# Altium project A7 Minima.PrjPcb (part 2 of 3)

## Sheet 5-3 fpga bank 14-16.SchDoc
size A4; SheetNumber: 7; SheetTotal: 13
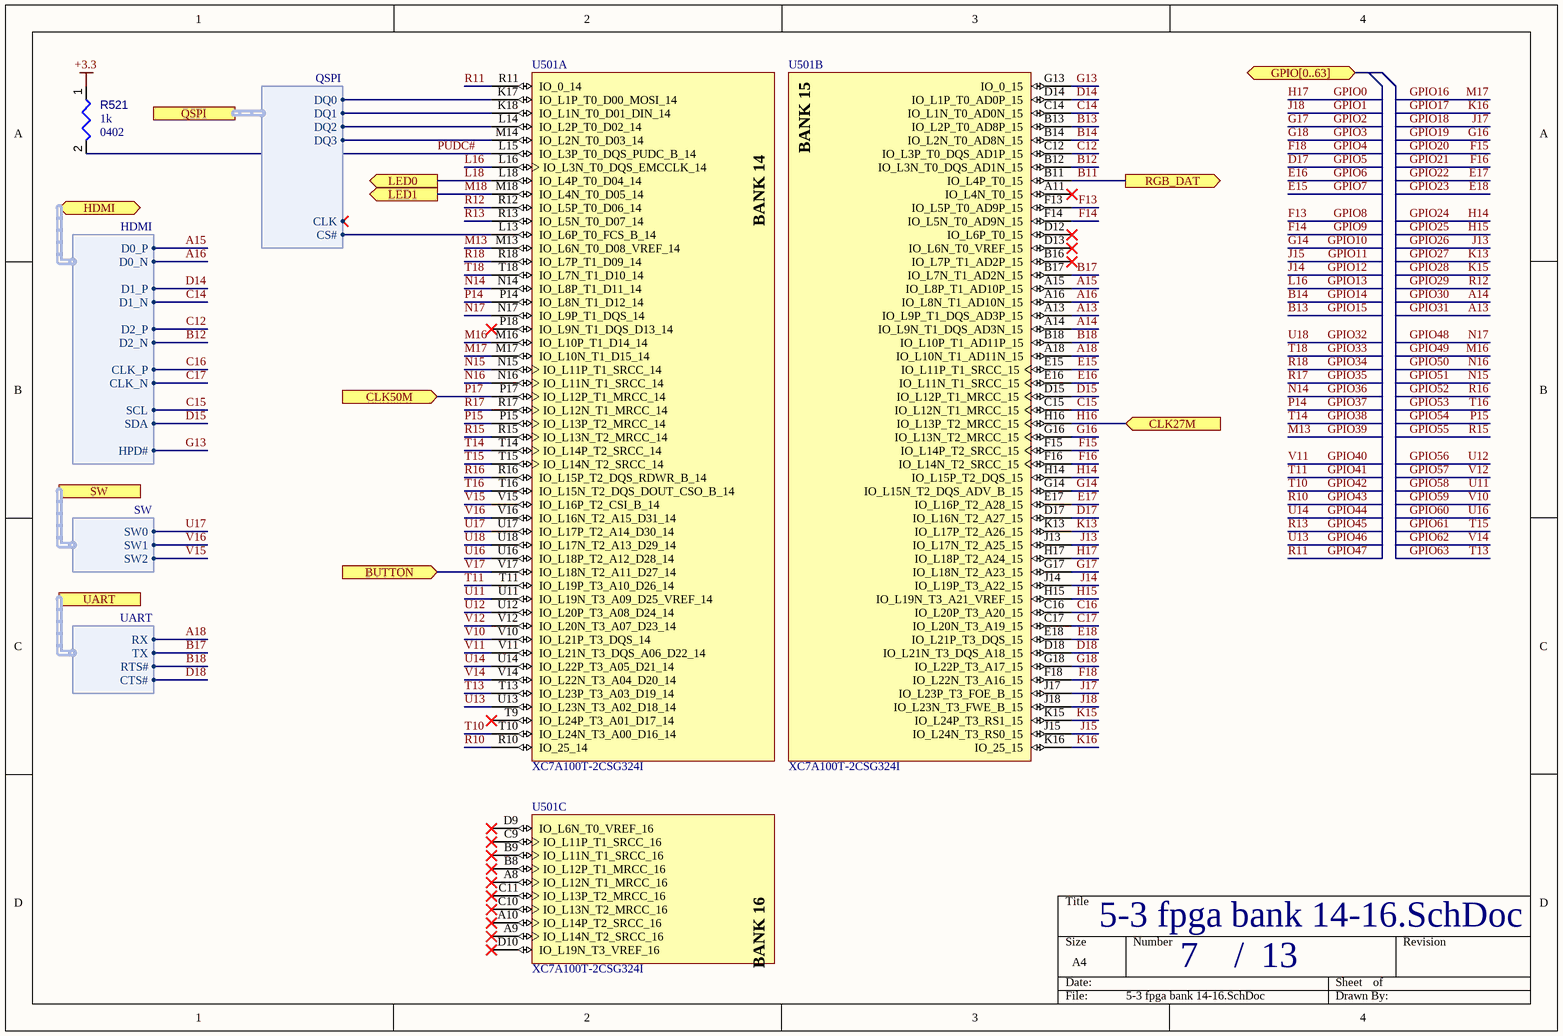
[diagram p7: 5-3 fpga bank 14-16.SchDoc]

### Parts
R521  value 1k  Case/Package: 0402  [RESC0402(1005)_L]  (hidden comment: Resistors,0402,1k)
U501  XC7A100T-2CSG324I  [CSG324]  (parts A,B,C of 9)

### Ports
BUTTON (in), CLK27M (in), CLK50M (in), GPIO[0..63] (bidir), HDMI (bidir, harness HDMI), LED0 (out), LED1 (out), QSPI (harness QSPI), RGB_DAT (out), SW (harness SW), UART (harness UART)

### Harnesses
QSPI: DQ0, DQ1, DQ2, DQ3, CS#, CLK
UART: TX, RX, RTS#, CTS#
SW: SW1, SW0, SW2
HDMI: D0_P, D0_N, D1_P, D1_N, D2_P, D2_N, CLK_P, CLK_N, SCL, SDA, HPD#

### Nets
+3.3: R521.1
A13: U501.A13(IO_L9P_T1_DQS_AD3P_15)  [also labelled GPIO31]  [project net A13_7]
A14: U501.A14(IO_L9N_T1_DQS_AD3N_15)  [also labelled GPIO30]  [project net A14_7]
A15: U501.A15(IO_L8P_T1_AD10P_15) ; port HDMI.D0_P  [project net HDMI.D0_P]
A16: U501.A16(IO_L8N_T1_AD10N_15) ; port HDMI.D0_N  [project net HDMI.D0_N]
A18: U501.A18(IO_L10N_T1_AD11N_15) ; port UART.RX  [project net UART.RX]
B11: U501.B11(IO_L4P_T0_15) ; port RGB_DAT  [project net RGB_DAT]
B12: U501.B12(IO_L3N_T0_DQS_AD1N_15) ; port HDMI.D2_N  [project net HDMI.D2_N]
B13: U501.B13(IO_L2P_T0_AD8P_15)  [also labelled GPIO15]  [project net B13_7]
B14: U501.B14(IO_L2N_T0_AD8N_15)  [also labelled GPIO14]  [project net B14_7]
B17: U501.B17(IO_L7N_T1_AD2N_15) ; port UART.TX  [project net UART.TX]
B18: U501.B18(IO_L10P_T1_AD11P_15) ; port UART.RTS#  [project net UART.RTS#]
C12: U501.C12(IO_L3P_T0_DQS_AD1P_15) ; port HDMI.D2_P  [project net HDMI.D2_P]
C14: U501.C14(IO_L1N_T0_AD0N_15) ; port HDMI.D1_N  [project net HDMI.D1_N]
C15: U501.C15(IO_L12N_T1_MRCC_15) ; port HDMI.SCL  [project net HDMI.SCL]
C16: U501.C16(IO_L20P_T3_A20_15) ; port HDMI.CLK_P  [project net HDMI.CLK_P]
C17: U501.C17(IO_L20N_T3_A19_15) ; port HDMI.CLK_N  [project net HDMI.CLK_N]
D14: U501.D14(IO_L1P_T0_AD0P_15) ; port HDMI.D1_P  [project net HDMI.D1_P]
D15: U501.D15(IO_L12P_T1_MRCC_15) ; port HDMI.SDA  [project net HDMI.SDA]
D17: U501.D17(IO_L16N_T2_A27_15)  [also labelled GPIO5]  [project net D17_7]
D18: U501.D18(IO_L21N_T3_DQS_A18_15) ; port UART.CTS#  [project net UART.CTS#]
E15: U501.E15(IO_L11P_T1_SRCC_15)  [also labelled GPIO7]  [project net E15_7]
E16: U501.E16(IO_L11N_T1_SRCC_15)  [also labelled GPIO6]  [project net E16_7]
E17: U501.E17(IO_L16P_T2_A28_15)  [also labelled GPIO22]  [project net E17_7]
E18: U501.E18(IO_L21P_T3_DQS_15)  [also labelled GPIO23]  [project net E18_7]
F13: U501.F13(IO_L5P_T0_AD9P_15)  [also labelled GPIO8]  [project net F13_7]
F14: U501.F14(IO_L5N_T0_AD9N_15)  [also labelled GPIO9]  [project net F14_7]
F15: U501.F15(IO_L14P_T2_SRCC_15)  [also labelled GPIO20]  [project net F15_7]
F16: U501.F16(IO_L14N_T2_SRCC_15)  [also labelled GPIO21]  [project net F16_7]
F18: U501.F18(IO_L22N_T3_A16_15)  [also labelled GPIO4]  [project net F18_7]
G13: U501.G13(IO_0_15) ; port HDMI.HPD#  [project net HDMI.HPD#]
G14: U501.G14(IO_L15N_T2_DQS_ADV_B_15)  [also labelled GPIO10]  [project net G14_7]
G16: U501.G16(IO_L13N_T2_MRCC_15)  [also labelled GPIO19]  [project net G16_7]
G17: U501.G17(IO_L18N_T2_A23_15)  [also labelled GPIO2]  [project net G17_7]
G18: U501.G18(IO_L22P_T3_A17_15)  [also labelled GPIO3]  [project net G18_7]
GPIO0: U501.H17(IO_L18P_T2_A24_15)  [also labelled H17]  [project net GPIO0_7]
GPIO1: U501.J18(IO_L23N_T3_FWE_B_15)  [also labelled J18]  [project net GPIO1_7]
GPIO11: U501.J15(IO_L24N_T3_RS0_15)  [also labelled J15]  [project net GPIO11_7]
GPIO12: U501.J14(IO_L19P_T3_A22_15)  [also labelled J14]  [project net GPIO12_7]
GPIO13: U501.L16(IO_L3N_T0_DQS_EMCCLK_14)  [also labelled L16]  [project net GPIO13_7]
GPIO16: U501.M17(IO_L10N_T1_D15_14)  [also labelled M17]  [project net GPIO16_7]
GPIO17: U501.K16(IO_25_15)  [also labelled K16]  [project net GPIO17_7]
GPIO18: U501.J17(IO_L23P_T3_FOE_B_15)  [also labelled J17]  [project net GPIO18_7]
GPIO24: U501.H14(IO_L15P_T2_DQS_15)  [also labelled H14]  [project net GPIO24_7]
GPIO25: U501.H15(IO_L19N_T3_A21_VREF_15)  [also labelled H15]  [project net GPIO25_7]
GPIO26: U501.J13(IO_L17N_T2_A25_15)  [also labelled J13]  [project net GPIO26_7]
GPIO27: U501.K13(IO_L17P_T2_A26_15)  [also labelled K13]  [project net GPIO27_7]
GPIO28: U501.K15(IO_L24P_T3_RS1_15)  [also labelled K15]  [project net GPIO28_7]
GPIO29: U501.R12(IO_L5P_T0_D06_14)  [also labelled R12]  [project net GPIO29_7]
GPIO32: U501.U18(IO_L17N_T2_A13_D29_14)  [also labelled U18]  [project net GPIO32_7]
GPIO33: U501.T18(IO_L7N_T1_D10_14)  [also labelled T18]  [project net GPIO33_7]
GPIO34: U501.R18(IO_L7P_T1_D09_14)  [also labelled R18]  [project net GPIO34_7]
GPIO35: U501.R17(IO_L12N_T1_MRCC_14)  [also labelled R17]  [project net GPIO35_7]
GPIO36: U501.N14(IO_L8P_T1_D11_14)  [also labelled N14]  [project net GPIO36_7]
GPIO37: U501.P14(IO_L8N_T1_D12_14)  [also labelled P14]  [project net GPIO37_7]
GPIO38: U501.T14(IO_L14P_T2_SRCC_14)  [also labelled T14]  [project net GPIO38_7]
GPIO39: U501.M13(IO_L6N_T0_D08_VREF_14)  [also labelled M13]  [project net GPIO39_7]
GPIO40: U501.V11(IO_L21N_T3_DQS_A06_D22_14)  [also labelled V11]  [project net GPIO40_7]
GPIO41: U501.T11(IO_L19P_T3_A10_D26_14)  [also labelled T11]  [project net GPIO41_7]
GPIO42: U501.T10(IO_L24N_T3_A00_D16_14)  [also labelled T10]  [project net GPIO42_7]
GPIO43: U501.R10(IO_25_14)  [also labelled R10]  [project net GPIO43_7]
GPIO44: U501.U14(IO_L22P_T3_A05_D21_14)  [also labelled U14]  [project net GPIO44_7]
GPIO45: U501.R13(IO_L5N_T0_D07_14)  [also labelled R13]  [project net GPIO45_7]
GPIO46: U501.U13(IO_L23N_T3_A02_D18_14)  [also labelled U13]  [project net GPIO46_7]
GPIO47: U501.R11(IO_0_14)  [also labelled R11]  [project net GPIO47_7]
GPIO48: U501.N17(IO_L9P_T1_DQS_14)  [also labelled N17]  [project net GPIO48_7]
GPIO49: U501.M16(IO_L10P_T1_D14_14)  [also labelled M16]  [project net GPIO49_7]
GPIO50: U501.N16(IO_L11N_T1_SRCC_14)  [also labelled N16]  [project net GPIO50_7]
GPIO51: U501.N15(IO_L11P_T1_SRCC_14)  [also labelled N15]  [project net GPIO51_7]
GPIO52: U501.R16(IO_L15P_T2_DQS_RDWR_B_14)  [also labelled R16]  [project net GPIO52_7]
GPIO53: U501.T16(IO_L15N_T2_DQS_DOUT_CSO_B_14)  [also labelled T16]  [project net GPIO53_7]
GPIO54: U501.P15(IO_L13P_T2_MRCC_14)  [also labelled P15]  [project net GPIO54_7]
GPIO55: U501.R15(IO_L13N_T2_MRCC_14)  [also labelled R15]  [project net GPIO55_7]
GPIO56: U501.U12(IO_L20P_T3_A08_D24_14)  [also labelled U12]  [project net GPIO56_7]
GPIO57: U501.V12(IO_L20N_T3_A07_D23_14)  [also labelled V12]  [project net GPIO57_7]
GPIO58: U501.U11(IO_L19N_T3_A09_D25_VREF_14)  [also labelled U11]  [project net GPIO58_7]
GPIO59: U501.V10(IO_L21P_T3_DQS_14)  [also labelled V10]  [project net GPIO59_7]
GPIO60: U501.U16(IO_L18P_T2_A12_D28_14)  [also labelled U16]  [project net GPIO60_7]
GPIO61: U501.T15(IO_L14N_T2_SRCC_14)  [also labelled T15]  [project net GPIO61_7]
GPIO62: U501.V14(IO_L22N_T3_A04_D20_14)  [also labelled V14]  [project net GPIO62_7]
GPIO63: U501.T13(IO_L23P_T3_A03_D19_14)  [also labelled T13]  [project net GPIO63_7]
H16: U501.H16(IO_L13P_T2_MRCC_15) ; port CLK27M  [project net CLK27M]
L18: U501.L18(IO_L4P_T0_D04_14) ; port LED0  [project net LED0]
M18: U501.M18(IO_L4N_T0_D05_14) ; port LED1  [project net LED1]
P17: U501.P17(IO_L12P_T1_MRCC_14) ; port CLK50M  [project net CLK50M]
PUDC#: R521.2 U501.L15(IO_L3P_T0_DQS_PUDC_B_14)  [project net PUDC#_7]
QSPI.CS#: U501.L13(IO_L6P_T0_FCS_B_14) ; port QSPI.CS#
QSPI.DQ0: U501.K17(IO_L1P_T0_D00_MOSI_14) ; port QSPI.DQ0
QSPI.DQ1: U501.K18(IO_L1N_T0_D01_DIN_14) ; port QSPI.DQ1
QSPI.DQ2: U501.L14(IO_L2P_T0_D02_14) ; port QSPI.DQ2
QSPI.DQ3: U501.M14(IO_L2N_T0_D03_14) ; port QSPI.DQ3
U17: U501.U17(IO_L17P_T2_A14_D30_14) ; port SW.SW0  [project net SW.SW0]
V15: U501.V15(IO_L16P_T2_CSI_B_14) ; port SW.SW2  [project net SW.SW2]
V16: U501.V16(IO_L16N_T2_A15_D31_14) ; port SW.SW1  [project net SW.SW1]
V17: U501.V17(IO_L18N_T2_A11_D27_14) ; port BUTTON  [project net BUTTON]

Not connected (* = marked no-connect by the designer): U501 A8(IO_L12N_T1_MRCC_16)* A9(IO_L14N_T2_SRCC_16)* A10(IO_L14P_T2_SRCC_16)* A11(IO_L4N_T0_15)* B8(IO_L12P_T1_MRCC_16)* B9(IO_L11N_T1_SRCC_16)* B16(IO_L7P_T1_AD2P_15)* C9(IO_L11P_T1_SRCC_16)* C10(IO_L13N_T2_MRCC_16)* C11(IO_L13P_T2_MRCC_16)* D9(IO_L6N_T0_VREF_16)* D10(IO_L19N_T3_VREF_16)* D12(IO_L6P_T0_15)* D13(IO_L6N_T0_VREF_15)* P18(IO_L9N_T1_DQS_D13_14)* T9(IO_L24P_T3_A01_D17_14)*

### Notes on the sheet
- /
- (in symbol CMP-0364-00002-3, part A) BANK 14
- (in symbol CMP-0364-00002-3, part B) BANK 15
- (in symbol CMP-0364-00002-3, part C) BANK 16

### Library data of the parts
R521 = Resistors: Resistor; Component Type: Resistors
U501 = CMP-0364-00002-3: as U501 on sheet 5-1 fgpa power; ComponentLink5URL: http://www.xilinx.com/support/documentation/user_guides/ug475_7Series_Pkg_Pinout.pdf; ComponentLink4Description: Package File; PackageDescription: Wire-Bond Chip-Scale BGA, Body 15 x 15 mm, 0.8 mm Pitch; RoHS: Pb-Free; ComponentLink5Description: Packaging and Pinout; ComponentLink2URL: http://www.xilinx.com/support/documentation/user_guides/ug475_7Series_Pkg_Pinout.pdf; ComponentLink2Description: Package Specification; PartNumber: XC7A100T-2CSG324I; Mounting Technology: Surface Mount; ComponentLink3Description: DC and Switching Characteristics; PackageVersion: Rev 1.8; Code_JEDEC: MO-275-KKAC-1; PackageReference: CSG324; NexusDeviceID: XC7A100T-2CSG324I; ComponentLink4URL: http://www.xilinx.com/support/packagefiles/a7packages/xc7a100tcsg324pkg.txt; ComponentLink3URL: http://www.xilinx.com/support/documentation/data_sheets/ds181_Artix_7_Data_Sheet.pdf; ComponentLink1Description: Datasheet; DatasheetVersion: v1.12; ComponentLink1URL: http://www.xilinx.com/support/documentation/data_sheets/ds180_7Series_Overview.pdf; Generic Part Number: XC7A100T; CLBs (Max Distributed RAM Kb): 1188

## Sheet 4 jtag uart.SchDoc
size A4; SheetNumber: 4; SheetTotal: 13
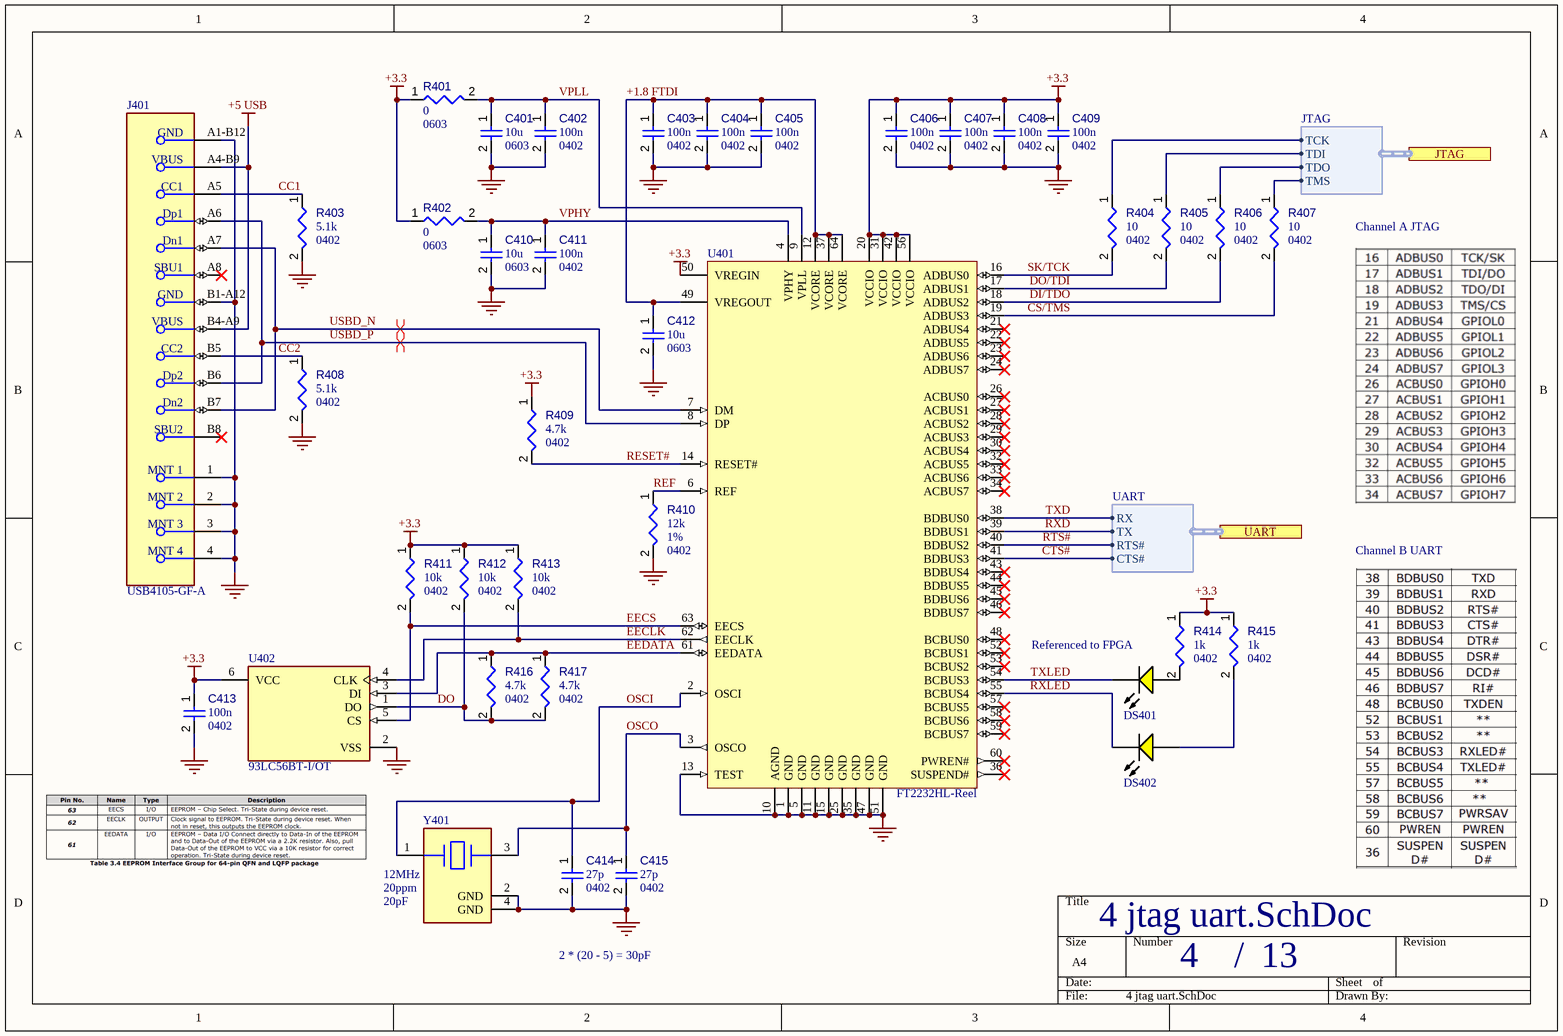
[diagram p8: 4 jtag uart.SchDoc]

### Parts
C401  value 10u  Case/Package: 0603  [CAPC0603(1608)100_L]  (hidden comment: Capacitors,0603,10u)
C402  value 100n  Case/Package: 0402  [CAPC0402(1005)60_L]  (hidden comment: Capacitors,0402,100n,16)
C403  value 100n  Case/Package: 0402  [CAPC0402(1005)60_L]  (hidden comment: Capacitors,0402,100n,16)
C404  value 100n  Case/Package: 0402  [CAPC0402(1005)60_L]  (hidden comment: Capacitors,0402,100n,16)
C405  value 100n  Case/Package: 0402  [CAPC0402(1005)60_L]  (hidden comment: Capacitors,0402,100n,16)
C406  value 100n  Case/Package: 0402  [CAPC0402(1005)60_L]  (hidden comment: Capacitors,0402,100n,16)
C407  value 100n  Case/Package: 0402  [CAPC0402(1005)60_L]  (hidden comment: Capacitors,0402,100n,16)
C408  value 100n  Case/Package: 0402  [CAPC0402(1005)60_L]  (hidden comment: Capacitors,0402,100n,16)
C409  value 100n  Case/Package: 0402  [CAPC0402(1005)60_L]  (hidden comment: Capacitors,0402,100n,16)
C410  value 10u  Case/Package: 0603  [CAPC0603(1608)100_L]  (hidden comment: Capacitors,0603,10u)
C411  value 100n  Case/Package: 0402  [CAPC0402(1005)60_L]  (hidden comment: Capacitors,0402,100n,16)
C412  value 10u  Case/Package: 0603  [CAPC0603(1608)100_L]  (hidden comment: Capacitors,0603,10u)
C413  value 100n  Case/Package: 0402  [CAPC0402(1005)60_L]  (hidden comment: Capacitors,0402,100n,16)
C414  value 27p  Case/Package: 0402  [CAPC0402(1005)60_L]  (hidden comment: Capacitors,0402,27p)
C415  value 27p  Case/Package: 0402  [CAPC0402(1005)60_L]  (hidden comment: Capacitors,0402,27p)
DS401  SML-LX0603YW-TR  [LUMX-SML-LX0603_V]  (value not drawn)
DS402  SML-LX0603YW-TR  [LUMX-SML-LX0603_V]  (value not drawn)
J401  USB4105-GF-A  [FP-USB4105-GF-A-MFG]
R401  value 0  Case/Package: 0603  [RESC0603(1608)_L]  (hidden comment: Resistors,0603,0)
R402  value 0  Case/Package: 0603  [RESC0603(1608)_L]  (hidden comment: Resistors,0603,0)
R403  value 5.1k  Case/Package: 0402  [RESC0402(1005)_L]  (hidden comment: Resistors,0402,5.1k)
R404  value 10  Case/Package: 0402  [RESC0402(1005)_L]  (hidden comment: Resistors,0402,10)
R405  value 10  Case/Package: 0402  [RESC0402(1005)_L]  (hidden comment: Resistors,0402,10)
R406  value 10  Case/Package: 0402  [RESC0402(1005)_L]  (hidden comment: Resistors,0402,10)
R407  value 10  Case/Package: 0402  [RESC0402(1005)_L]  (hidden comment: Resistors,0402,10)
R408  value 5.1k  Case/Package: 0402  [RESC0402(1005)_L]  (hidden comment: Resistors,0402,5.1k)
R409  value 4.7k  Case/Package: 0402  [RESC0402(1005)_L]  (hidden comment: Resistors,0402,4.7k)
R410  value 12k  Case/Package: 0402  Tolerance: 1%  [RESC0402(1005)_L]  (hidden comment: Resistors,0402,1%,12k)
R411  value 10k  Case/Package: 0402  [RESC0402(1005)_L]  (hidden comment: Resistors,0402,10k)
R412  value 10k  Case/Package: 0402  [RESC0402(1005)_L]  (hidden comment: Resistors,0402,10k)
R413  value 10k  Case/Package: 0402  [RESC0402(1005)_L]  (hidden comment: Resistors,0402,10k)
R414  value 1k  Case/Package: 0402  [RESC0402(1005)_L]  (hidden comment: Resistors,0402,1k)
R415  value 1k  Case/Package: 0402  [RESC0402(1005)_L]  (hidden comment: Resistors,0402,1k)
R416  value 4.7k  Case/Package: 0402  [RESC0402(1005)_L]  (hidden comment: Resistors,0402,4.7k)
R417  value 4.7k  Case/Package: 0402  [RESC0402(1005)_L]  (hidden comment: Resistors,0402,4.7k)
U401  FT2232HL-Reel  [LQFP-64_L]
U402  93LC56BT-I/OT  [FP-C04-028-MFG]
Y401  Frequency: 12MHz  Frequency Stability: 20ppm  Load Capacitance: 20pF  [FP-NX3225SA-MFG]  (hidden comment: NX3225SA-12.000M-STD-CRS-2)

### Ports
JTAG (harness JTAG), UART (harness UART)

### Harnesses
UART: TX, RX, RTS#, CTS#
JTAG: TCK, TDI, TDO, TMS

### Nets
+3.3: C406.1 C407.1 C408.1 C409.1 C413.1 R401.1 R402.1 R409.1 R411.1 R412.1 R413.1 R414.1 R415.1 U401.20(VCCIO) U401.31(VCCIO) U401.42(VCCIO) U401.50(VREGIN) U401.56(VCCIO) U402.6(VCC)
+5 USB: J401.A4-B9(VBUS) J401.B4-A9(VBUS)
GND: C401.2 C402.2 C403.2 C404.2 C405.2 C406.2 C407.2 C408.2 C409.2 C410.2 C411.2 C412.2 C413.2 C414.2 C415.2 J401.1(MNT_1) J401.2(MNT_2) J401.3(MNT_3) J401.4(MNT_4) J401.A1-B12(GND) J401.B1-A12(GND) R403.2 R408.2 R410.2 U401.1(GND) U401.5(GND) U401.10(AGND) U401.11(GND) U401.13(TEST) U401.15(GND) U401.25(GND) U401.35(GND) U401.47(GND) U401.51(GND) U402.2(VSS) Y401.2(GND) Y401.4(GND)
+1.8 FTDI: C403.1 C404.1 C405.1 C412.1 U401.12(VCORE) U401.37(VCORE) U401.49(VREGOUT) U401.64(VCORE)  [project net +1.8 FTDI_4]
CC1: J401.A5(CC1) R403.1  [project net CC1_4]
CC2: J401.B5(CC2) R408.1  [project net CC2_4]
CS/TMS: R407.2 U401.19(ADBUS3)  [project net CS/TMS_4]
CTS#: U401.41(BDBUS3) ; port UART.CTS#  [project net UART.CTS#]
DI/TDO: R406.2 U401.18(ADBUS2)  [project net DI/TDO_4]
DO: R412.2 R416.2 R417.2 U402.1(DO)  [project net DO_4]
DO/TDI: R405.2 U401.17(ADBUS1)  [project net DO/TDI_4]
EECLK: R413.2 U401.62(EECLK) U402.4(CLK)  [project net EECLK_4]
EECS: R411.2 U401.63(EECS) U402.5(CS)  [project net EECS_4]
EEDATA: R416.1 R417.1 U401.61(EEDATA) U402.3(DI)  [project net EEDATA_4]
JTAG.TCK: R404.1 ; port JTAG.TCK
JTAG.TDI: R405.1 ; port JTAG.TDI
JTAG.TDO: R406.1 ; port JTAG.TDO
JTAG.TMS: R407.1 ; port JTAG.TMS
OSCI: C414.1 U401.2(OSCI) Y401.1  [project net OSCI_4]
OSCO: C415.1 U401.3(OSCO) Y401.3  [project net OSCO_4]
REF: R410.1 U401.6(REF)  [project net REF_4]
RESET#: R409.2 U401.14(RESET#)  [project net RESET#_4]
RTS#: U401.40(BDBUS2) ; port UART.RTS#  [project net UART.RTS#]
RXD: U401.39(BDBUS1) ; port UART.TX  [project net UART.TX]
RXLED: DS402.2(K) U401.55(BCBUS4)  [project net RXLED_4]
SK/TCK: R404.2 U401.16(ADBUS0)  [project net SK/TCK_4]
TXD: U401.38(BDBUS0) ; port UART.RX  [project net UART.RX]
TXLED: DS401.2(K) U401.54(BCBUS3)  [project net TXLED_4]
USBD_N: J401.A7(Dn1) J401.B7(Dn2) U401.7(DM)  [project net USBD_N_4]
USBD_P: J401.A6(Dp1) J401.B6(Dp2) U401.8(DP)  [project net USBD_P_4]
VPHY: C410.1 C411.1 R402.2 U401.4(VPHY)  [project net VPHY_4]
VPLL: C401.1 C402.1 R401.2 U401.9(VPLL)  [project net VPLL_4]
NetDS401_1: DS401.1(A) R414.2
NetDS402_1: DS402.1(A) R415.2

Not connected (* = marked no-connect by the designer): J401 A8(SBU1)* B8(SBU2)*; U401 21(ADBUS4)* 22(ADBUS5)* 23(ADBUS6)* 24(ADBUS7)* 26(ACBUS0)* 27(ACBUS1)* 28(ACBUS2)* 29(ACBUS3)* 30(ACBUS4)* 32(ACBUS5)* 33(ACBUS6)* 34(ACBUS7)* 36(SUSPEND#)* 43(BDBUS4)* 44(BDBUS5)* 45(BDBUS6)* 46(BDBUS7)* 48(BCBUS0)* 52(BCBUS1)* 53(BCBUS2)* 57(BCBUS5)* 58(BCBUS6)* 59(BCBUS7)* 60(PWREN#)*

### Layout directives
differential pair: USBD_N_4, USBD_P_4

### Notes on the sheet
- Channel A JTAG
- Channel B UART
- Referenced to FPGA
- 2 * (20 - 5) = 30pF
- /

### Library data of the parts
C401 C410 C412 C414 C415 = Capacitors: Capacitor; Component Type: Capacitors
C402-C409 C411 C413 = Capacitors: Capacitor; Voltage Rating: 16; Component Type: Capacitors
DS401 DS402 = CMP-2000-07121-1: Yellow LED, Milky White Diffused Lens, 2.1 V, 14 mcd, -25 to 85 degC, 2-Pin SMD, RoHS, Tape and Reel; Manufacturer: Lumex; COO: CN; Number of LEDs: 1; Type: Uni-Color; Intensity: 14mcd; Reverse Voltage: 5(Min)V; LED Material: GaAsP; Viewing Angle: 160; Peak Wavelength: 585nm; Pin_Count: 2; Lens Appearance: ColorlessDiffused; Operating Temperature: -25to85C; Color: Yellow; Mounting Technology: SurfaceMount; Package Description: 2-Pin Surface Mount Device, Body 1.6 x 0.8 mm; Mounting: SurfaceMount; Packaging: TapeandReel; RoHS: Unknown; Supplier_Package: SMD; Package Reference: SML-LX00603; Part No: SML-LX0603YW-TR; Datasheet URL: http://www.lumex.com/content/files/ProductAttachment/SML-LX0603YW-TR.pdf; Dimension: 1.6x0.8x0.6mm; Manufacturer URL: http://www.lumexinstruments.com/; HTS: 8541402000; Datasheet Version: Rev. G, 09/2013; Lens Dimensions: 1x0.8x0.3mm; Dominant Wavelength: N/A; ECCN: EARII; Supplier: Lumex; Family: SML-LX0603YW
J401 = CMP-245163-000001-1: CONN RCPT USB2.0 TYPEC 5A; Manufacturer: GCT; Voltage Rating: 20V; Is Female: yes; Current Rating: 5/6.25/1.25/0.25A; Number Of Contacts: 16; Conn Orientation: Right Angle; Device Class L1: Connectors; Category: Conn; Lead Free: Yes; RoHS: TRUE; Temperature Range High: +85°C; Digikey Description: CONN RCPT USB2.0 TYPEC 5A; Device Class L3: unset; ComponentLink2Description: Datasheet; Manufacturer Part Number: USB4105-GF-A; Package: 0; Usb Standard: USB 2.0; Device Class L2: USB Connectors; Automotive: No; Temperature Range Low: -40°C; Height: 3.46mm; Temperature: -40°C to +85°C; Contact Material: Gold,Nickel; ComponentLink2URL: https://gct.co/files/drawings/usb4105.pdf; Octopart: https://octopart.com/usb4105-gf-a-gct-106627878
R401-R417 = Resistors: Resistor; Component Type: Resistors
U401 = CMP-0078-00023-3: Dual High Speed USB To Multipurpose UART/FIFO IC, 64-pin LQFP, Tape and Reel; Manufacturer: FTDI; DatasheetVersion: ver 2.21, Jun-2012; ComponentLink1URL: http://www.ftdichip.com/; PartNumber: FT2232HL-Reel; ComponentLink2Description: Datasheet; RevisionNote: DatasheetVersion updated to 2.21 Jun-2012; PackageVersion: Jun-12; ComponentLink1Description: Manufacturer URL; ComponentLink2URL: http://www.ftdichip.com/Support/Documents/DataSheets/ICs/DS_FT2232H.pdf; PackageReference: LQFP-64; PackageDescription: 64-Pin Thin Quad Flat Pack, 10 x 10 x 1.4 mm Body, 0.5 mm Pitch
U402 = CMP-0162-00356-2: IC EEPROM 2K SPI 2MHZ SOT23-6; Access Time: 250ns; Density: 2Kb; Max Supply Voltage: 5.5V; Interface: Serial; Min Supply Voltage: 2.5V; Nominal Supply Current: 2mA; Number of Pins: 6; Radiation Hardening: No; Length: 3.1mm; Height: 1.3mm; Min Operating Temperature: -40°C; Max Operating Temperature: 85°C; Lead Free: Lead Free; Memory Type: EEPROM; Contact Plating: Tin; REACH SVHC: No SVHC; Package Quantity: 3000; Frequency: 2MHz; Width: 1.8mm; Max Frequency: 2MHz; Case/Package: SOT-23; Mount: Surface Mount; Packaging: Tape and Reel; Memory Size: 2Kb
Y401 = CMP-200220-000016-1: Frequency Tolerance: 10ppm; ESR (Equivalent Series Resistance): 50R; Case/Package: SMD/SMT; RoHS Compliant: Yes; Mount: Surface Mount; Ratings: AEC-Q200; Length: 0.126inch; Packaging: Tape and Reel; Width: 0.098inch; Min Operating Temperature: -40°C; Height: 0.024inch; Max Operating Temperature: 125°C

## Sheet 5-2 fpga config.SchDoc
size A4; SheetNumber: 6; SheetTotal: 13
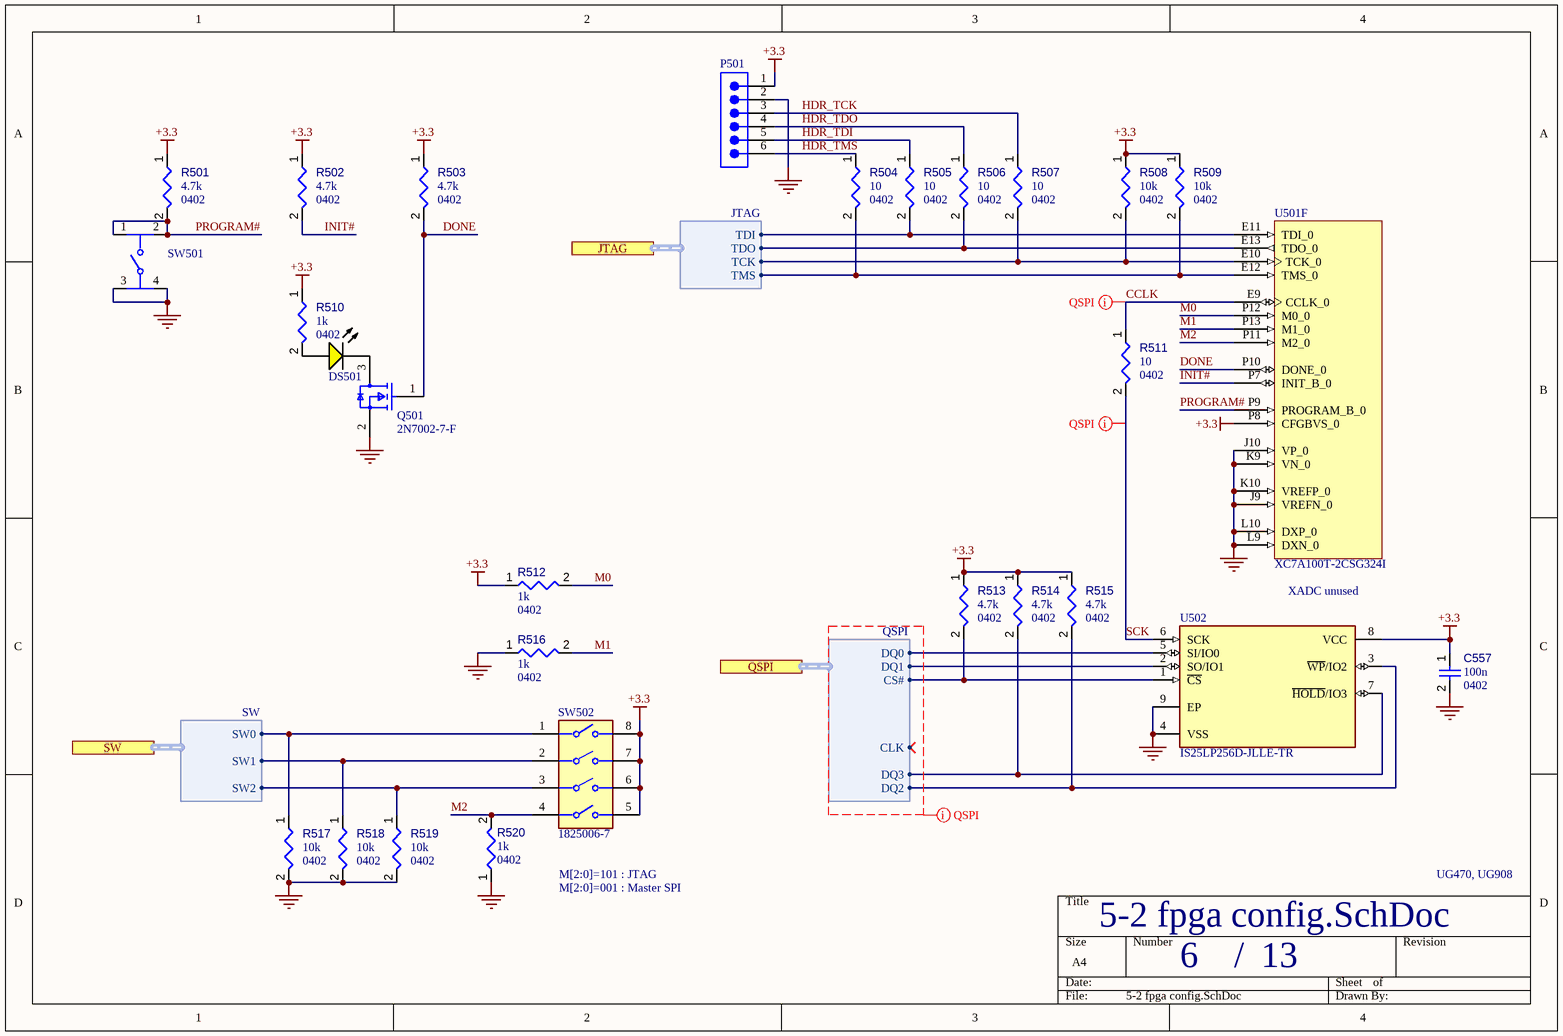
[diagram p9: 5-2 fpga config.SchDoc]

### Parts
C557  value 100n  Case/Package: 0402  [CAPC0402(1005)60_L]  (hidden comment: Capacitors,0402,100n,16)
DS501  SML-LX0603YW-TR  [LUMX-SML-LX0603_V]  (value not drawn)
P501  TSW-106-07-F-S  [SMTC-TSW-106-07-X-S]  (value not drawn)
Q501  2N7002-7-F  [FP-SOT23-MFG]
R501  value 4.7k  Case/Package: 0402  [RESC0402(1005)_L]  (hidden comment: Resistors,0402,4.7k)
R502  value 4.7k  Case/Package: 0402  [RESC0402(1005)_L]  (hidden comment: Resistors,0402,4.7k)
R503  value 4.7k  Case/Package: 0402  [RESC0402(1005)_L]  (hidden comment: Resistors,0402,4.7k)
R504  value 10  Case/Package: 0402  [RESC0402(1005)_L]  (hidden comment: Resistors,0402,10)
R505  value 10  Case/Package: 0402  [RESC0402(1005)_L]  (hidden comment: Resistors,0402,10)
R506  value 10  Case/Package: 0402  [RESC0402(1005)_L]  (hidden comment: Resistors,0402,10)
R507  value 10  Case/Package: 0402  [RESC0402(1005)_L]  (hidden comment: Resistors,0402,10)
R508  value 10k  Case/Package: 0402  [RESC0402(1005)_L]  (hidden comment: Resistors,0402,10k)
R509  value 10k  Case/Package: 0402  [RESC0402(1005)_L]  (hidden comment: Resistors,0402,10k)
R510  value 1k  Case/Package: 0402  [RESC0402(1005)_L]  (hidden comment: Resistors,0402,1k)
R511  value 10  Case/Package: 0402  [RESC0402(1005)_L]  (hidden comment: Resistors,0402,10)
R512  value 1k  Case/Package: 0402  [RESC0402(1005)_L]  (hidden comment: Resistors,0402,1k)
R513  value 4.7k  Case/Package: 0402  [RESC0402(1005)_L]  (hidden comment: Resistors,0402,4.7k)
R514  value 4.7k  Case/Package: 0402  [RESC0402(1005)_L]  (hidden comment: Resistors,0402,4.7k)
R515  value 4.7k  Case/Package: 0402  [RESC0402(1005)_L]  (hidden comment: Resistors,0402,4.7k)
R516  value 1k  Case/Package: 0402  [RESC0402(1005)_L]  (hidden comment: Resistors,0402,1k)
R517  value 10k  Case/Package: 0402  [RESC0402(1005)_L]  (hidden comment: Resistors,0402,10k)
R518  value 10k  Case/Package: 0402  [RESC0402(1005)_L]  (hidden comment: Resistors,0402,10k)
R519  value 10k  Case/Package: 0402  [RESC0402(1005)_L]  (hidden comment: Resistors,0402,10k)
R520  value 1k  Case/Package: 0402  [RESC0402(1005)_L]  (hidden comment: Resistors,0402,1k)
SW501  PTS810SJM250SMTRLFS  [FP-PTS810SJM250SMTRLFS-MFG]  (value not drawn)
SW502  1825006-7  [FP-1825006-7-MFG]
U501  XC7A100T-2CSG324I  [CSG324]  (part F of 9)
U502  IS25LP256D-JLLE-TR  [FP-PG-WSON-8-IPC_A]

### Ports
JTAG (harness JTAG), QSPI (harness QSPI), SW (harness SW)

### Harnesses
QSPI: DQ0, DQ1, DQ2, DQ3, CS#, CLK
JTAG: TCK, TDI, TDO, TMS
SW: SW1, SW0, SW2

### Nets
+3.3: C557.1 P501.1 R501.1 R502.1 R503.1 R508.1 R509.1 R510.1 R512.1 R513.1 R514.1 R515.1 SW502.5 SW502.6 SW502.7 SW502.8 U501.P8(CFGBVS_0) U502.8(VCC)
GND: C557.2 P501.2 Q501.2(S) R516.1 R517.2 R518.2 R519.2 R520.1 SW501.3 SW501.4 U501.J9(VREFN_0) U501.J10(VP_0) U501.K9(VN_0) U501.K10(VREFP_0) U501.L9(DXN_0) U501.L10(DXP_0) U502.4(VSS) U502.9(EP)
CCLK: R511.1 U501.E9(CCLK_0)  [project net CCLK_6]
DONE: Q501.1(G) R503.2 U501.P10(DONE_0)  [project net DONE_6]
HDR_TCK: P501.3 R507.1  [project net HDR_TCK_6]
HDR_TDI: P501.5 R505.1  [project net HDR_TDI_6]
HDR_TDO: P501.4 R506.1  [project net HDR_TDO_6]
HDR_TMS: P501.6 R504.1  [project net HDR_TMS_6]
INIT#: R502.2 U501.P7(INIT_B_0)  [project net INIT#_6]
JTAG.TCK: R507.2 R508.2 U501.E10(TCK_0) ; port JTAG.TCK
JTAG.TDI: R505.2 U501.E11(TDI_0) ; port JTAG.TDI
JTAG.TDO: R506.2 U501.E13(TDO_0) ; port JTAG.TDO
JTAG.TMS: R504.2 R509.2 U501.E12(TMS_0) ; port JTAG.TMS
M0: R512.2 U501.P12(M0_0)  [project net M0_6]
M1: R516.2 U501.P13(M1_0)  [project net M1_6]
M2: R520.2 SW502.4 U501.P11(M2_0)  [project net M2_6]
PROGRAM#: R501.2 SW501.1 SW501.2 U501.P9(PROGRAM_B_0)  [project net PROGRAM#_6]
QSPI.CS#: R513.2 U502.1(~{CS}) ; port QSPI.CS#
QSPI.DQ0: U502.5(SI/IO0) ; port QSPI.DQ0
QSPI.DQ1: U502.2(SO/IO1) ; port QSPI.DQ1
QSPI.DQ2: R515.2 U502.3(~{WP}/IO2) ; port QSPI.DQ2
QSPI.DQ3: R514.2 U502.7(~{HOLD}/IO3) ; port QSPI.DQ3
SCK: R511.2 U502.6(SCK)  [project net SCK_6]
SW.SW0: R517.1 SW502.1 ; port SW.SW0
SW.SW1: R518.1 SW502.2 ; port SW.SW1
SW.SW2: R519.1 SW502.3 ; port SW.SW2
NetDS501_1: DS501.1(A) R510.2
NetDS501_2: DS501.2(K) Q501.3(D)

### Layout directives
net class QSPI: (no net found under the mark), CCLK_6, SCK_6

### Notes on the sheet
- XADC unused
- M[2:0]=101 : JTAG
- M[2:0]=001 : Master SPI
- UG470, UG908
- /

### Library data of the parts
C557 = Capacitors: Capacitor; Voltage Rating: 16; Component Type: Capacitors
DS501 = CMP-2000-07121-1: as DS401 on sheet 4 jtag uart; Operating Temperature: -25to85C; Color: Yellow; Mounting Technology: SurfaceMount; Package Description: 2-Pin Surface Mount Device, Body 1.6 x 0.8 mm; Mounting: SurfaceMount; Packaging: TapeandReel; RoHS: Unknown; Supplier_Package: SMD; Package Reference: SML-LX00603; Part No: SML-LX0603YW-TR; Datasheet URL: http://www.lumex.com/content/files/ProductAttachment/SML-LX0603YW-TR.pdf; Dimension: 1.6x0.8x0.6mm; Manufacturer URL: http://www.lumexinstruments.com/; HTS: 8541402000; Datasheet Version: Rev. G, 09/2013; Lens Dimensions: 1x0.8x0.3mm; Dominant Wavelength: N/A; ECCN: EARII; Supplier: Lumex; Family: SML-LX0603YW
P501 = CMP-1024-00385-1: 0.025" SQ Post Header, Through-hole, Vertical, -55 to 125 degC, 2.54 mm Pitch, 6-Pin, Male, RoHS; Manufacturer: Samtec; Pitch: 2.54 mm; Orientation: Vertical; RoHS: True; ComponentLink3Description: Package Specification; PartNumber: TSW-106-07-F-S; Temperature Range: -55 to 125 degC; PackageVersion: DM, 8/1988; ComponentLink2URL: http://www.samtec.com/documents/webfiles/pdf/TSW_TH.PDF; ComponentLink1Description: Manufacturer URL; ComponentLink2Description: Datasheet; ComponentLink1URL: http://www.samtec.com; DatasheetVersion: F-214; PackageReference: TSW-106-07-X-S; PackageDescription: .025[0.64] SQ. Post Terminal Strip Assembly; ComponentLink3URL: http://www.samtec.com/documents/webfiles/cpdf/TSW-XXX-XX-XXX-X-XX-XXX-MKT.pdf; Mounting Technology: Through-hole
Q501 = CMP-2000-04929-2: MOSFET N-CH 60V 115MA SOT23-3; Turn-On Delay Time: 7ns; Turn-Off Delay Time: 11ns; Drain to Source Resistance: 7.5R; Rise Time: 3ns; Drain to Source Breakdown Voltage: 70V; Input Capacitance: 50pF; Number of Elements: 1; Power Dissipation: 540mW; Max Power Dissipation: 300mW; Fall Time: 5.6ns; Gate to Source Voltage (Vgs): 20V; Threshold Voltage: 2.5V; Element Configuration: Single; Termination: SMD/SMT; Weight: 0.000282oz; Radiation Hardening: No; Max Operating Temperature: 150°C; On-State Resistance: 7.5R; Mount: Surface Mount; Current Rating: 115mA; Contact Plating: Tin; Lead Free: Lead Free; Min Operating Temperature: -55°C; Number of Pins: 3; REACH SVHC: No SVHC; Drain to Source Voltage (Vdss): 60V; Width: 1.3mm; Package Quantity: 3000; Length: 2.9mm; Case/Package: SOT-23; Number of Channels: 1; Dual Supply Voltage: 60V; Packaging: Tape and Reel; Height: 1mm; Voltage Rating (DC): 60V; Nominal Vgs: 2.5V; Continuous Drain Current (ID): 115mA; Voltage: 60V; Rds On Max: 7.5R
R501-R520 = Resistors: Resistor; Component Type: Resistors
SW501 = CMP-10040-000001-2: SWITCH TACTILE SPST-NO 0.05A 16V; Throw Configuration: SPST; Operating Force: 160gf; Actuator Type: Standard; Switch Travel: 0.15mm; Switch Function: Off-Mom; Max Current Rating: 50mA; Mechanical Life: 150000Cycles; Illumination Type: Non-Illuminated; Package Quantity: 2900; Depth: 4.6mm; Mount: Surface Mount; Packaging: Tape and Reel; Length: 3.2mm; RoHS Compliant: Yes; Case/Package: SMD/SMT; Voltage Rating (DC): 16V; Min Operating Temperature: -40°C; Termination: J-Bend; Lead Free: Lead Free; Contact Plating: Silver; Orientation: Straight; Max Operating Temperature: 85°C; Current Rating: 50mA; Color: Black
SW502 = CMP-03400-000035-1: SWITCH SLIDE DIP SPST 25MA 24V; Sealable: Yes (With); Actuator Length: 0mm; Voltage Rating (DC): 50V; Electrical Life: 1000Cycles; Contact Current Rating: 100mA; Contact Resistance: 100mR; Number of Positions: 4; Actuator Type: Standard; Switching Capacity: 400mW; Actuator Material: Polymer; Pitch: 0.1inch; Washable: Yes; Contact Post Length: 0.169inch; Package Quantity: 40; Mount: Surface Mount; Height: 2.7mm; Flammability Rating: UL94 V-0; Length: 0.394inch; Max Current Rating: 25mA; Housing Material: Polyphenylene; Terminal Pitch: 2.54mm; Housing Color: Black; Series: GDS, Alcoswitch; Radiation Hardening: No; Throw Configuration: SPST; Max Voltage Rating (DC): 24V; Contact Material: Copper Alloy; Number of Circuits: 4; Number of Pins: 4; ELV: Compliant; Type: Switch; REACH SVHC: No SVHC; Lead Free: Lead Free; Depth: 9.3mm; Termination: Gull Wing; Width: 8.15mm; Orientation: Straight; Max Operating Temperature: 85°C; Contact Plating: Gold; Min Operating Temperature: -30°C; Packaging: Rail/Tube
U501 = CMP-0364-00002-3: Artix-7 FPGA, 210 User I/Os, 0 GTP, 324-Ball BGA, Speed Grade 2, Extended Grade, Pb-Free; Manufacturer: Xilinx; Block RAM Blocks (36Kb): 135; Logic Cells: 101440; Clock Mgmt Tiles (CMTs): 6; Block RAM Blocks (18Kb): 270; CLBs (Slices): 15850; Block RAM Blocks (Max Kb): 4860; Max User I/O: 300; Speed Grade: -2; DSP48E1 Slices: 240; ComponentLink5URL: http://www.xilinx.com/support/documentation/user_guides/ug475_7Series_Pkg_Pinout.pdf; ComponentLink4Description: Package File; PackageDescription: Wire-Bond Chip-Scale BGA, Body 15 x 15 mm, 0.8 mm Pitch; RoHS: Pb-Free; ComponentLink5Description: Packaging and Pinout; ComponentLink2URL: http://www.xilinx.com/support/documentation/user_guides/ug475_7Series_Pkg_Pinout.pdf; ComponentLink2Description: Package Specification; PartNumber: XC7A100T-2CSG324I; Mounting Technology: Surface Mount; ComponentLink3Description: DC and Switching Characteristics; PackageVersion: Rev 1.8; Code_JEDEC: MO-275-KKAC-1; PackageReference: CSG324; NexusDeviceID: XC7A100T-2CSG324I; ComponentLink4URL: http://www.xilinx.com/support/packagefiles/a7packages/xc7a100tcsg324pkg.txt; ComponentLink3URL: http://www.xilinx.com/support/documentation/data_sheets/ds181_Artix_7_Data_Sheet.pdf; ComponentLink1Description: Datasheet; DatasheetVersion: v1.12; ComponentLink1URL: http://www.xilinx.com/support/documentation/data_sheets/ds180_7Series_Overview.pdf; Generic Part Number: XC7A100T; CLBs (Max Distributed RAM Kb): 1188
U502 = CMP-00196-112300326-1: S25FL256SAGNFV000 128 Mbit (16 Mbyte)/256 Mbit (32 Mbyte) 3.0V SPI Flash Memory; NexarPartId: 112300326

## Sheet 7 ddr3 memory.SchDoc
size A4; SheetNumber: 10; SheetTotal: 13
Used 2 times, as channels DM, DM. Parts and nets are listed once, with the designators drawn on the sheet.
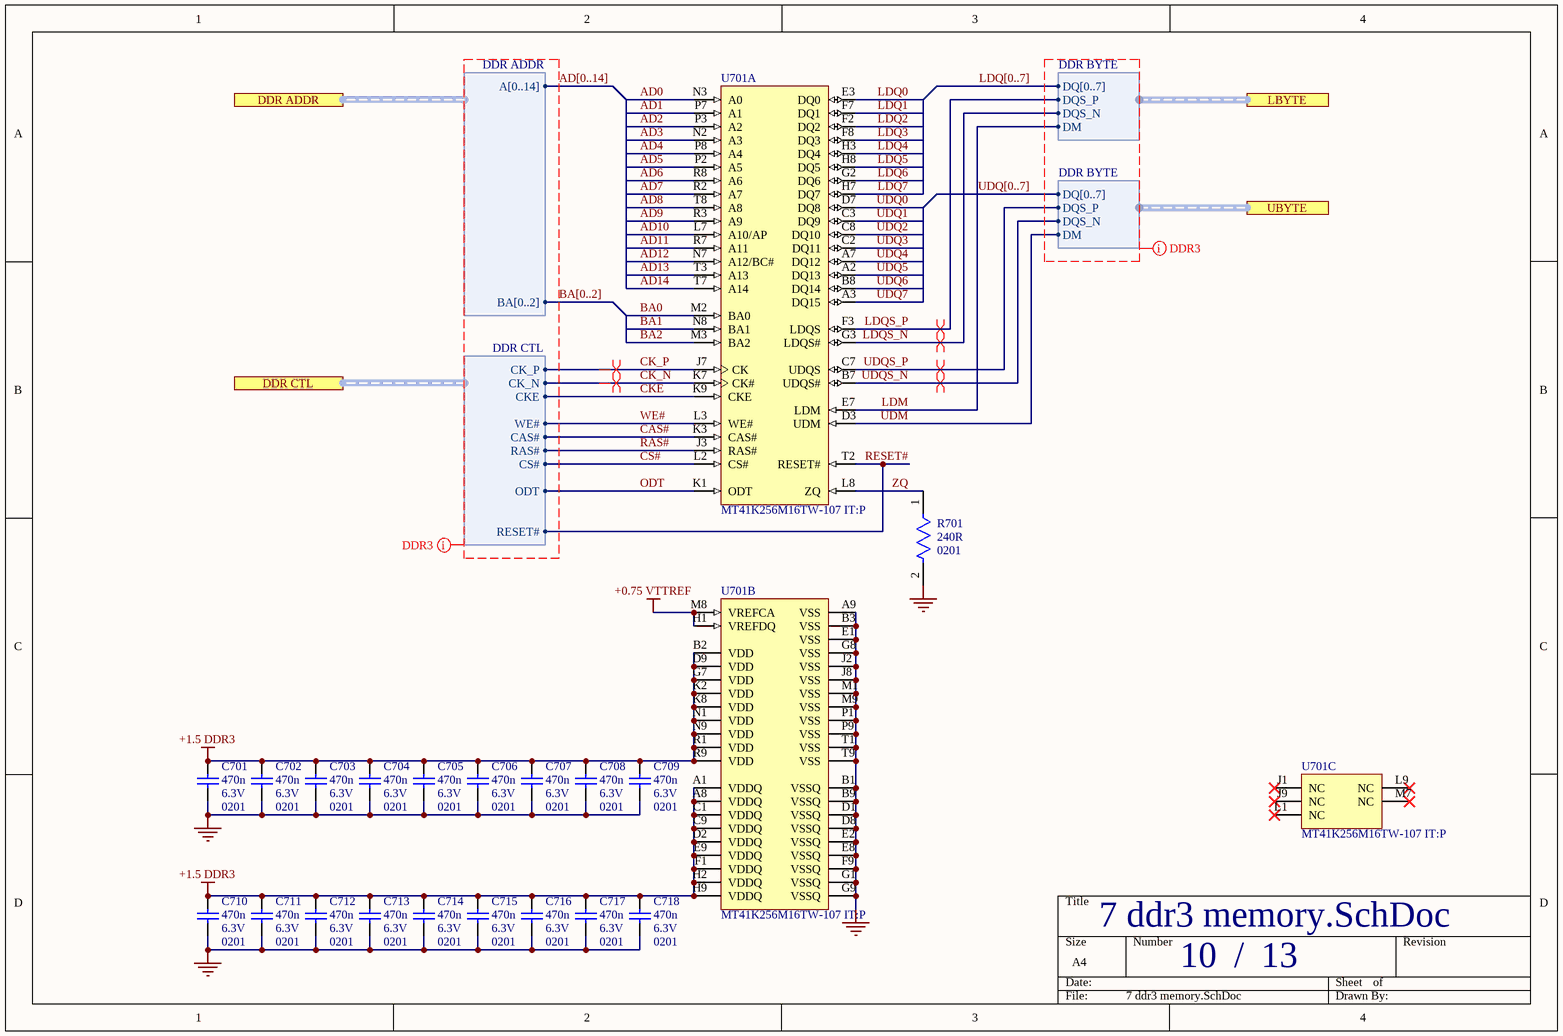
[diagram p10: 7 ddr3 memory.SchDoc]

### Parts
C701  value 470n  Voltage Rating: 6.3V  Package: 0201  [CAPC0603X33X15LL03T05]  (hidden comment: 02016D474KAT2A)
C702  value 470n  Voltage Rating: 6.3V  Package: 0201  [CAPC0603X33X15LL03T05]  (hidden comment: 02016D474KAT2A)
C703  value 470n  Voltage Rating: 6.3V  Package: 0201  [CAPC0603X33X15LL03T05]  (hidden comment: 02016D474KAT2A)
C704  value 470n  Voltage Rating: 6.3V  Package: 0201  [CAPC0603X33X15LL03T05]  (hidden comment: 02016D474KAT2A)
C705  value 470n  Voltage Rating: 6.3V  Package: 0201  [CAPC0603X33X15LL03T05]  (hidden comment: 02016D474KAT2A)
C706  value 470n  Voltage Rating: 6.3V  Package: 0201  [CAPC0603X33X15LL03T05]  (hidden comment: 02016D474KAT2A)
C707  value 470n  Voltage Rating: 6.3V  Package: 0201  [CAPC0603X33X15LL03T05]  (hidden comment: 02016D474KAT2A)
C708  value 470n  Voltage Rating: 6.3V  Package: 0201  [CAPC0603X33X15LL03T05]  (hidden comment: 02016D474KAT2A)
C709  value 470n  Voltage Rating: 6.3V  Package: 0201  [CAPC0603X33X15LL03T05]  (hidden comment: 02016D474KAT2A)
C710  value 470n  Voltage Rating: 6.3V  Package: 0201  [CAPC0603X33X15LL03T05]  (hidden comment: 02016D474KAT2A)
C711  value 470n  Voltage Rating: 6.3V  Package: 0201  [CAPC0603X33X15LL03T05]  (hidden comment: 02016D474KAT2A)
C712  value 470n  Voltage Rating: 6.3V  Package: 0201  [CAPC0603X33X15LL03T05]  (hidden comment: 02016D474KAT2A)
C713  value 470n  Voltage Rating: 6.3V  Package: 0201  [CAPC0603X33X15LL03T05]  (hidden comment: 02016D474KAT2A)
C714  value 470n  Voltage Rating: 6.3V  Package: 0201  [CAPC0603X33X15LL03T05]  (hidden comment: 02016D474KAT2A)
C715  value 470n  Voltage Rating: 6.3V  Package: 0201  [CAPC0603X33X15LL03T05]  (hidden comment: 02016D474KAT2A)
C716  value 470n  Voltage Rating: 6.3V  Package: 0201  [CAPC0603X33X15LL03T05]  (hidden comment: 02016D474KAT2A)
C717  value 470n  Voltage Rating: 6.3V  Package: 0201  [CAPC0603X33X15LL03T05]  (hidden comment: 02016D474KAT2A)
C718  value 470n  Voltage Rating: 6.3V  Package: 0201  [CAPC0603X33X15LL03T05]  (hidden comment: 02016D474KAT2A)
R701  Case/Package: 0201  Resistance: 240R  [FP-RMCF0201-IPC_C]  (hidden comment: RMCF0201FG240R)
U701  MT41K256M16TW-107 IT:P  [MICT-TW-96]  (parts A,B,C of 3)

### Ports
DDR ADDR (harness DDR ADDR), DDR CTL (harness DDR CTL), LBYTE (harness DDR BYTE), UBYTE (harness DDR BYTE)

### Harnesses
DDR ADDR: A[0..14], BA[0..2]
DDR CTL: CK_P, CK_N, CKE, WE#, CAS#, RAS#, CS#, ODT, RESET#
DDR BYTE: DQ[0..7], DQS_P, DQS_N, DM

### Nets
+0.75 VTTREF: U701.H1(VREFDQ) U701.M8(VREFCA)
+1.5 DDR3: C701.1 C702.1 C703.1 C704.1 C705.1 C706.1 C707.1 C708.1 C709.1 C710.1 C711.1 C712.1 C713.1 C714.1 C715.1 C716.1 C717.1 C718.1 U701.A1(VDDQ) U701.A8(VDDQ) U701.B2(VDD) U701.C1(VDDQ) U701.C9(VDDQ) U701.D2(VDDQ) U701.D9(VDD) U701.E9(VDDQ) U701.F1(VDDQ) U701.G7(VDD) U701.H2(VDDQ) U701.H9(VDDQ) U701.K2(VDD) U701.K8(VDD) U701.N1(VDD) U701.N9(VDD) U701.R1(VDD) U701.R9(VDD)
GND: C701.2 C702.2 C703.2 C704.2 C705.2 C706.2 C707.2 C708.2 C709.2 C710.2 C711.2 C712.2 C713.2 C714.2 C715.2 C716.2 C717.2 C718.2 R701.2 U701.A9(VSS) U701.B1(VSSQ) U701.B3(VSS) U701.B9(VSSQ) U701.D1(VSSQ) U701.D8(VSSQ) U701.E1(VSS) U701.E2(VSSQ) U701.E8(VSSQ) U701.F9(VSSQ) U701.G1(VSSQ) U701.G8(VSS) U701.G9(VSSQ) U701.J2(VSS) U701.J8(VSS) U701.M1(VSS) U701.M9(VSS) U701.P1(VSS) U701.P9(VSS) U701.T1(VSS) U701.T9(VSS)
AD0: U701.N3(A0)  [project net AD0_10]
AD1: U701.P7(A1)  [project net AD1_10]
AD2: U701.P3(A2)  [project net AD2_10]
AD3: U701.N2(A3)  [project net AD3_10]
AD4: U701.P8(A4)  [project net AD4_10]
AD5: U701.P2(A5)  [project net AD5_10]
AD6: U701.R8(A6)  [project net AD6_10]
AD7: U701.R2(A7)  [project net AD7_10]
AD8: U701.T8(A8)  [project net AD8_10]
AD9: U701.R3(A9)  [project net AD9_10]
AD10: U701.L7(A10/AP)  [project net AD10_10]
AD11: U701.R7(A11)  [project net AD11_10]
AD12: U701.N7(A12/BC#)  [project net AD12_10]
AD13: U701.T3(A13)  [project net AD13_10]
AD14: U701.T7(A14)  [project net AD14_10]
BA0: U701.M2(BA0)  [project net BA0_10]
BA1: U701.N8(BA1)  [project net BA1_10]
BA2: U701.M3(BA2)  [project net BA2_10]
CAS#: U701.K3(CAS#) ; port DDR CTL.CAS#
CK_N: U701.K7(CK#) ; port DDR CTL.CK_N
CK_P: U701.J7(CK) ; port DDR CTL.CK_P
CKE: U701.K9(CKE) ; port DDR CTL.CKE
CS#: U701.L2(CS#) ; port DDR CTL.CS#
LDM: U701.E7(LDM) ; port LBYTE.DM
LDQ0: U701.E3(DQ0)  [project net LDQ0_10]
LDQ1: U701.F7(DQ1)  [project net LDQ1_10]
LDQ2: U701.F2(DQ2)  [project net LDQ2_10]
LDQ3: U701.F8(DQ3)  [project net LDQ3_10]
LDQ4: U701.H3(DQ4)  [project net LDQ4_10]
LDQ5: U701.H8(DQ5)  [project net LDQ5_10]
LDQ6: U701.G2(DQ6)  [project net LDQ6_10]
LDQ7: U701.H7(DQ7)  [project net LDQ7_10]
LDQS_N: U701.G3(LDQS#) ; port LBYTE.DQS_N
LDQS_P: U701.F3(LDQS) ; port LBYTE.DQS_P
ODT: U701.K1(ODT) ; port DDR CTL.ODT
RAS#: U701.J3(RAS#) ; port DDR CTL.RAS#
RESET#: U701.T2(RESET#) ; port DDR CTL.RESET#
UDM: U701.D3(UDM) ; port UBYTE.DM
UDQ0: U701.D7(DQ8)  [project net UDQ0_10]
UDQ1: U701.C3(DQ9)  [project net UDQ1_10]
UDQ2: U701.C8(DQ10)  [project net UDQ2_10]
UDQ3: U701.C2(DQ11)  [project net UDQ3_10]
UDQ4: U701.A7(DQ12)  [project net UDQ4_10]
UDQ5: U701.A2(DQ13)  [project net UDQ5_10]
UDQ6: U701.B8(DQ14)  [project net UDQ6_10]
UDQ7: U701.A3(DQ15)  [project net UDQ7_10]
UDQS_N: U701.B7(UDQS#) ; port UBYTE.DQS_N
UDQS_P: U701.C7(UDQS) ; port UBYTE.DQS_P
WE#: U701.L3(WE#) ; port DDR CTL.WE#
ZQ: R701.1 U701.L8(ZQ)  [project net ZQ_10]

Not connected (* = marked no-connect by the designer): U701 J1(NC)* J9(NC)* L1(NC)* L9(NC)* M7(NC)*

### Channels
DM: designators end in _DM#1
DM: designators end in _DM#2

### Buses and harness runs
bus AD[0..14]
bus BA[0..2]
bus LDQ[0..7]
bus UDQ[0..7]

### Layout directives
differential pair: DDRB2.DQS_N, DDRB2.DQS_P, DDRB3.DQS_N, DDRB3.DQS_P, DDRCTL.CK_N, DDRCTL.CK_P
net class DDR3: (no net found under the mark), AD[0..14], BA[0..2]

### Notes on the sheet
- /

### Library data of the parts
C701-C718 = CMP-2010-00405-1: Manufacturer: AVX Interconnect / Elco; Part Number: 02016D474KAT2A
R701 = CMP-26527-006303-1: 240Ω ±1% 0.05W 0201 Thick Film Chip Resistor AEC-Q200 compliant; Temperature Coefficient: 200ppm/°C; Max Power Dissipation: 50mW; Tolerance: 1%; Resistor Type: Thick Film; Case Code (Imperial): 0201; Case Code (Metric): 0603; Min Operating Temperature: -55°C; Length: 0.024inch; Packaging: Tape and Reel; Max Operating Temperature: 125°C; Number of Terminations: 2; Width: 0.012inch; Height: 0.009inch
U701 = CMP-2000-06773-2: Automotive DDR3L SDRAM, 4 GB, 933 MHz, 1.283 to 1.45 V, -40 to 95 degC, 96-Pin TFBGA, RoHS, Tray; Manufacturer: Micron; Data Bus Width: 16b; Address Bus Width: 15b; Operating Supply Voltage: 1.35V; Access Time: 1.07ns; Max Frequency: 933MHz; Density: 4Gb; Package Reference: TW-96; Max Operating Temperature: 95degC; RoHSCompliant: true; Datasheet Version: Rev. D, 02/2017; Datasheet URL: https://www.micron.com/~/media/documents/products/data-sheet/dram/ddr3/4gb_automotive_ddr3l.pdf; Mount: SurfaceMount; Min Operating Temperature: -40degC; Package Description: 96-Ball Fine Pitch Ball Grid Array, Body 14 x 8 mm, Pitch 0.8 mm; Mounting Technology: SurfaceMount; Contact Plating: Silver; Manufacturer URL: http://www.micron.com/

## Sheet 8 ddr3 termination.SchDoc
size A4; SheetNumber: 11; SheetTotal: 13
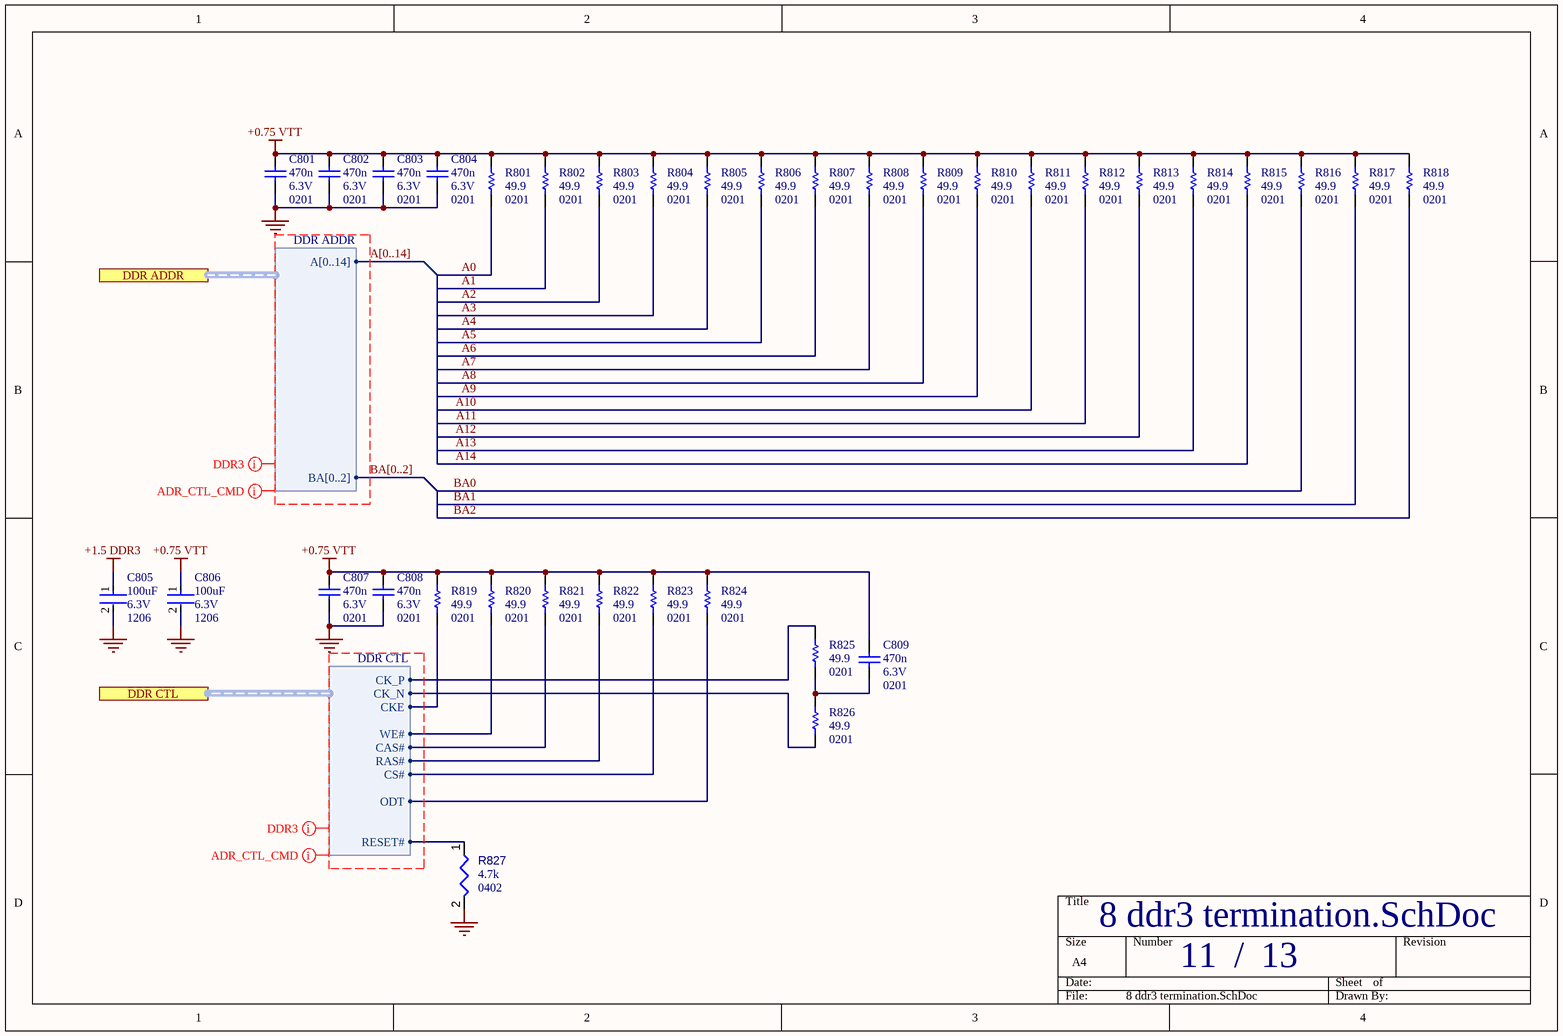
[diagram p11: 8 ddr3 termination.SchDoc]

### Parts
C801  value 470n  Voltage Rating: 6.3V  Package: 0201  [CAPC0603X33X15LL03T05]  (hidden comment: 02016D474KAT2A)
C802  value 470n  Voltage Rating: 6.3V  Package: 0201  [CAPC0603X33X15LL03T05]  (hidden comment: 02016D474KAT2A)
C803  value 470n  Voltage Rating: 6.3V  Package: 0201  [CAPC0603X33X15LL03T05]  (hidden comment: 02016D474KAT2A)
C804  value 470n  Voltage Rating: 6.3V  Package: 0201  [CAPC0603X33X15LL03T05]  (hidden comment: 02016D474KAT2A)
C805  Case Code (Imperial): 1206  Voltage Rating (DC): 6.3V  Capacitance: 100uF  [FP-C1206C-EH-MFG]  (hidden comment: C1206C107M9PACTU)
C806  Case Code (Imperial): 1206  Voltage Rating (DC): 6.3V  Capacitance: 100uF  [FP-C1206C-EH-MFG]  (hidden comment: C1206C107M9PACTU)
C807  value 470n  Voltage Rating: 6.3V  Package: 0201  [CAPC0603X33X15LL03T05]  (hidden comment: 02016D474KAT2A)
C808  value 470n  Voltage Rating: 6.3V  Package: 0201  [CAPC0603X33X15LL03T05]  (hidden comment: 02016D474KAT2A)
C809  value 470n  Voltage Rating: 6.3V  Package: 0201  [CAPC0603X33X15LL03T05]  (hidden comment: 02016D474KAT2A)
R801  value 49.9  Package: 0201  [RESC0603X28X15LL05T05]  (hidden comment: CRCW020149R9FKED)
R802  value 49.9  Package: 0201  [RESC0603X28X15LL05T05]  (hidden comment: CRCW020149R9FKED)
R803  value 49.9  Package: 0201  [RESC0603X28X15LL05T05]  (hidden comment: CRCW020149R9FKED)
R804  value 49.9  Package: 0201  [RESC0603X28X15LL05T05]  (hidden comment: CRCW020149R9FKED)
R805  value 49.9  Package: 0201  [RESC0603X28X15LL05T05]  (hidden comment: CRCW020149R9FKED)
R806  value 49.9  Package: 0201  [RESC0603X28X15LL05T05]  (hidden comment: CRCW020149R9FKED)
R807  value 49.9  Package: 0201  [RESC0603X28X15LL05T05]  (hidden comment: CRCW020149R9FKED)
R808  value 49.9  Package: 0201  [RESC0603X28X15LL05T05]  (hidden comment: CRCW020149R9FKED)
R809  value 49.9  Package: 0201  [RESC0603X28X15LL05T05]  (hidden comment: CRCW020149R9FKED)
R810  value 49.9  Package: 0201  [RESC0603X28X15LL05T05]  (hidden comment: CRCW020149R9FKED)
R811  value 49.9  Package: 0201  [RESC0603X28X15LL05T05]  (hidden comment: CRCW020149R9FKED)
R812  value 49.9  Package: 0201  [RESC0603X28X15LL05T05]  (hidden comment: CRCW020149R9FKED)
R813  value 49.9  Package: 0201  [RESC0603X28X15LL05T05]  (hidden comment: CRCW020149R9FKED)
R814  value 49.9  Package: 0201  [RESC0603X28X15LL05T05]  (hidden comment: CRCW020149R9FKED)
R815  value 49.9  Package: 0201  [RESC0603X28X15LL05T05]  (hidden comment: CRCW020149R9FKED)
R816  value 49.9  Package: 0201  [RESC0603X28X15LL05T05]  (hidden comment: CRCW020149R9FKED)
R817  value 49.9  Package: 0201  [RESC0603X28X15LL05T05]  (hidden comment: CRCW020149R9FKED)
R818  value 49.9  Package: 0201  [RESC0603X28X15LL05T05]  (hidden comment: CRCW020149R9FKED)
R819  value 49.9  Package: 0201  [RESC0603X28X15LL05T05]  (hidden comment: CRCW020149R9FKED)
R820  value 49.9  Package: 0201  [RESC0603X28X15LL05T05]  (hidden comment: CRCW020149R9FKED)
R821  value 49.9  Package: 0201  [RESC0603X28X15LL05T05]  (hidden comment: CRCW020149R9FKED)
R822  value 49.9  Package: 0201  [RESC0603X28X15LL05T05]  (hidden comment: CRCW020149R9FKED)
R823  value 49.9  Package: 0201  [RESC0603X28X15LL05T05]  (hidden comment: CRCW020149R9FKED)
R824  value 49.9  Package: 0201  [RESC0603X28X15LL05T05]  (hidden comment: CRCW020149R9FKED)
R825  value 49.9  Package: 0201  [RESC0603X28X15LL05T05]  (hidden comment: CRCW020149R9FKED)
R826  value 49.9  Package: 0201  [RESC0603X28X15LL05T05]  (hidden comment: CRCW020149R9FKED)
R827  value 4.7k  Case/Package: 0402  [RESC0402(1005)_L]  (hidden comment: Resistors,0402,4.7k)

### Ports
DDR ADDR (harness DDR ADDR), DDR CTL (harness DDR CTL)

### Harnesses
DDR ADDR: A[0..14], BA[0..2]
DDR CTL: CK_P, CK_N, CKE, WE#, CAS#, RAS#, CS#, ODT, RESET#

### Nets
+0.75 VTT: C801.1 C802.1 C803.1 C804.1 C806.1 C807.1 C808.1 C809.1 R801.2 R802.2 R803.2 R804.2 R805.2 R806.2 R807.2 R808.2 R809.2 R810.2 R811.2 R812.2 R813.2 R814.2 R815.2 R816.2 R817.2 R818.2 R819.2 R820.2 R821.2 R822.2 R823.2 R824.2
+1.5 DDR3: C805.1
GND: C801.2 C802.2 C803.2 C804.2 C805.2 C806.2 C807.2 C808.2 R827.2
A0: R801.1
A1: R802.1
A2: R803.1
A3: R804.1
A4: R805.1
A5: R806.1
A6: R807.1
A7: R808.1
A8: R809.1
A9: R810.1
A10: R811.1
A11: R812.1
A12: R813.1
A13: R814.1
A14: R815.1
BA0: R816.1  [project net B3]
BA1: R817.1
BA2: R818.1
DDRCTL.CAS#: R821.1 ; port DDR CTL.CAS#
DDRCTL.CK_N: R826.1 ; port DDR CTL.CK_N
DDRCTL.CK_P: R825.2 ; port DDR CTL.CK_P
DDRCTL.CKE: R819.1 ; port DDR CTL.CKE
DDRCTL.CS#: R823.1 ; port DDR CTL.CS#
DDRCTL.ODT: R824.1 ; port DDR CTL.ODT
DDRCTL.RAS#: R822.1 ; port DDR CTL.RAS#
DDRCTL.RESET#: R827.1 ; port DDR CTL.RESET#
DDRCTL.WE#: R820.1 ; port DDR CTL.WE#
NetC809_2: C809.2 R825.1 R826.2

### Buses and harness runs
bus A[0..14]
bus BA[0..2]

### Layout directives
net class ADR_CTL_CMD: (no net found under the mark), A[0..14], BA[0..2]
net class DDR3: (no net found under the mark), A[0..14], BA[0..2]

### Notes on the sheet
- /

### Library data of the parts
C801-C804 C807-C809 = CMP-2010-00405-1: Manufacturer: AVX Interconnect / Elco; Part Number: 02016D474KAT2A
C805 C806 = CMP-1037-05005-3: CAP CER 100UF 6.3V X5R 1206; Dielectric Material: Ceramic; Tolerance: 2%; Dissipation Factor: 5%; Min Operating Temperature: -55°C; Case Code (Metric): 3216; Depth: 1.6mm; Dielectric: X5R; Max Operating Temperature: 85°C; Packaging: Tape and Reel; Construction: Flat; Series: C; Case/Package: 1206; Radiation Hardening: No; Termination: SMD/SMT; Voltage Rating: 6.3V; Number of Pins: 2; RoHS Compliant: Yes; Height: 1.6mm; Lead Free: Lead Free; Voltage: 6.3V; REACH SVHC: No SVHC; Length: 3.2mm; Mount: Surface Mount; Package Quantity: 1; Thickness: 0.071inch; Width: 0.063inch
R801-R826 = CMP-2004-00654-1: Manufacturer: Vishay Dale; Part Number: CRCW020149R9FKED
R827 = Resistors: Resistor; Component Type: Resistors

## Sheet 10 header.SchDoc
size A4; SheetNumber: 13; SheetTotal: 13
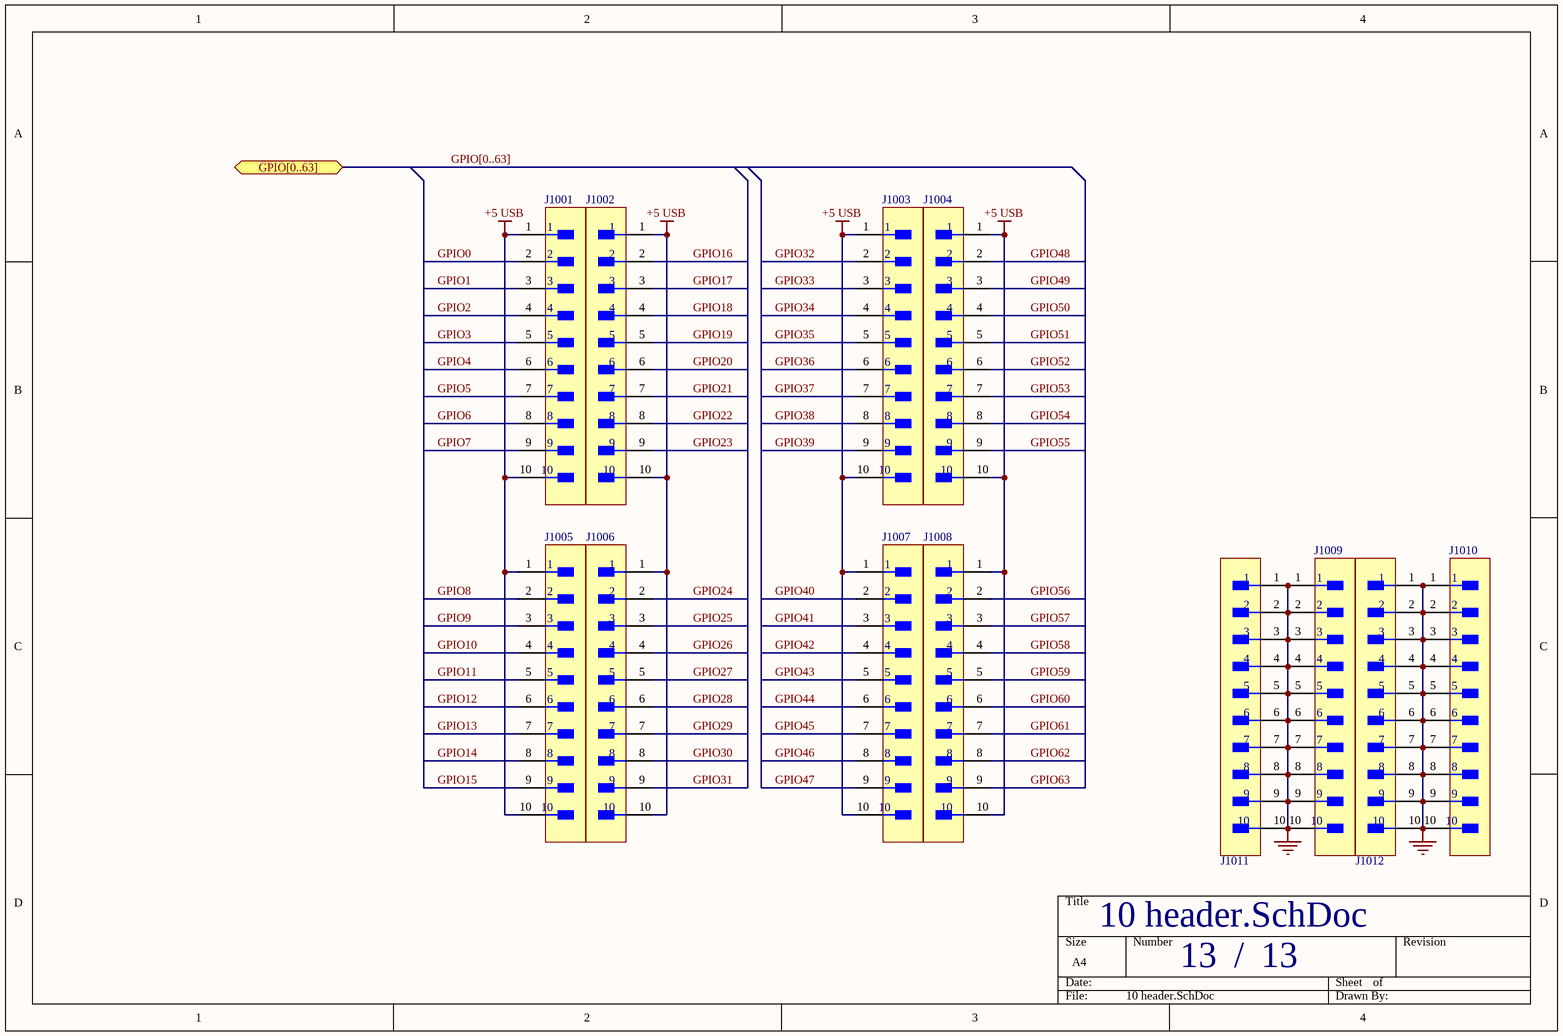
[diagram p12: 10 header.SchDoc]

### Parts
J1001  TSW-110-07-T-S  [FP-TSW-110-07-T-S-MFG]  (value not drawn)
J1002  TSW-110-07-T-S  [FP-TSW-110-07-T-S-MFG]  (value not drawn)
J1003  TSW-110-07-T-S  [FP-TSW-110-07-T-S-MFG]  (value not drawn)
J1004  TSW-110-07-T-S  [FP-TSW-110-07-T-S-MFG]  (value not drawn)
J1005  TSW-110-07-T-S  [FP-TSW-110-07-T-S-MFG]  (value not drawn)
J1006  TSW-110-07-T-S  [FP-TSW-110-07-T-S-MFG]  (value not drawn)
J1007  TSW-110-07-T-S  [FP-TSW-110-07-T-S-MFG]  (value not drawn)
J1008  TSW-110-07-T-S  [FP-TSW-110-07-T-S-MFG]  (value not drawn)
J1009  TSW-110-07-T-S  [FP-TSW-110-07-T-S-MFG]  (value not drawn)
J1010  TSW-110-07-T-S  [FP-TSW-110-07-T-S-MFG]  (value not drawn)
J1011  TSW-110-07-T-S  [FP-TSW-110-07-T-S-MFG]  (value not drawn)
J1012  TSW-110-07-T-S  [FP-TSW-110-07-T-S-MFG]  (value not drawn)

### Ports
GPIO[0..63] (bidir)

### Nets
+5 USB: J1001.1 J1001.10 J1002.1 J1002.10 J1003.1 J1003.10 J1004.1 J1004.10 J1005.1 J1005.10 J1006.1 J1006.10 J1007.1 J1007.10 J1008.1 J1008.10
GND: J1009.1 J1009.2 J1009.3 J1009.4 J1009.5 J1009.6 J1009.7 J1009.8 J1009.9 J1009.10 J1010.1 J1010.2 J1010.3 J1010.4 J1010.5 J1010.6 J1010.7 J1010.8 J1010.9 J1010.10 J1011.1 J1011.2 J1011.3 J1011.4 J1011.5 J1011.6 J1011.7 J1011.8 J1011.9 J1011.10 J1012.1 J1012.2 J1012.3 J1012.4 J1012.5 J1012.6 J1012.7 J1012.8 J1012.9 J1012.10
GPIO0: J1001.2  [project net GPIO0_1]
GPIO1: J1001.3  [project net GPIO1_1]
GPIO2: J1001.4  [project net GPIO2_1]
GPIO3: J1001.5  [project net GPIO3_1]
GPIO4: J1001.6  [project net GPIO4_1]
GPIO5: J1001.7  [project net GPIO5_1]
GPIO6: J1001.8  [project net GPIO6_1]
GPIO7: J1001.9  [project net GPIO7_1]
GPIO8: J1005.2  [project net GPIO8_1]
GPIO9: J1005.3  [project net GPIO9_1]
GPIO10: J1005.4  [project net GPIO10_1]
GPIO11: J1005.5  [project net GPIO11_1]
GPIO12: J1005.6  [project net GPIO12_1]
GPIO13: J1005.7  [project net GPIO13_1]
GPIO14: J1005.8  [project net GPIO14_1]
GPIO15: J1005.9  [project net GPIO15_1]
GPIO16: J1002.2  [project net GPIO16_1]
GPIO17: J1002.3  [project net GPIO17_1]
GPIO18: J1002.4  [project net GPIO18_1]
GPIO19: J1002.5  [project net GPIO19_1]
GPIO20: J1002.6  [project net GPIO20_1]
GPIO21: J1002.7  [project net GPIO21_1]
GPIO22: J1002.8  [project net GPIO22_1]
GPIO23: J1002.9  [project net GPIO23_1]
GPIO24: J1006.2  [project net GPIO24_1]
GPIO25: J1006.3  [project net GPIO25_1]
GPIO26: J1006.4  [project net GPIO26_1]
GPIO27: J1006.5  [project net GPIO27_1]
GPIO28: J1006.6  [project net GPIO28_1]
GPIO29: J1006.7  [project net GPIO29_1]
GPIO30: J1006.8  [project net GPIO30_1]
GPIO31: J1006.9  [project net GPIO31_1]
GPIO32: J1003.2  [project net GPIO32_1]
GPIO33: J1003.3  [project net GPIO33_1]
GPIO34: J1003.4  [project net GPIO34_1]
GPIO35: J1003.5  [project net GPIO35_1]
GPIO36: J1003.6  [project net GPIO36_1]
GPIO37: J1003.7  [project net GPIO37_1]
GPIO38: J1003.8  [project net GPIO38_1]
GPIO39: J1003.9  [project net GPIO39_1]
GPIO40: J1007.2  [project net GPIO40_1]
GPIO41: J1007.3  [project net GPIO41_1]
GPIO42: J1007.4  [project net GPIO42_1]
GPIO43: J1007.5  [project net GPIO43_1]
GPIO44: J1007.6  [project net GPIO44_1]
GPIO45: J1007.7  [project net GPIO45_1]
GPIO46: J1007.8  [project net GPIO46_1]
GPIO47: J1007.9  [project net GPIO47_1]
GPIO48: J1004.2  [project net GPIO48_1]
GPIO49: J1004.3  [project net GPIO49_1]
GPIO50: J1004.4  [project net GPIO50_1]
GPIO51: J1004.5  [project net GPIO51_1]
GPIO52: J1004.6  [project net GPIO52_1]
GPIO53: J1004.7  [project net GPIO53_1]
GPIO54: J1004.8  [project net GPIO54_1]
GPIO55: J1004.9  [project net GPIO55_1]
GPIO56: J1008.2  [project net GPIO56_1]
GPIO57: J1008.3  [project net GPIO57_1]
GPIO58: J1008.4  [project net GPIO58_1]
GPIO59: J1008.5  [project net GPIO59_1]
GPIO60: J1008.6  [project net GPIO60_1]
GPIO61: J1008.7  [project net GPIO61_1]
GPIO62: J1008.8  [project net GPIO62_1]
GPIO63: J1008.9  [project net GPIO63_1]

### Buses and harness runs
bus GPIO[0..63] = port GPIO[0..63]

### Notes on the sheet
- /

### Library data of the parts
J1001-J1012 = CMP-00575-00272505-1: TSW-110-07-T-S TSW - Samtec 2.54mm Pin Header 10.92mm Overall Pin Length (07) (mcv)(TO22); Manufacturer Lifecycle Status: PRODUCTION; Connector Type: Male Pin; Number of Positions: 10; Max Current Rating: 7.6A; Gender: Male; Max Voltage Rating (AC): 550V; Max Operating Temperature: 105°C; Packaging: Bulk; Lead Free: Lead Free; Min Operating Temperature: -55°C; Width: 2.54mm; RoHS: Compliant; Depth: 2.54mm; Lifecycle Status: Production; REACH SVHC: No SVHC; Height: 8.71mm; Number of Rows: 1; Housing Material: Polyester; Orientation: Straight; Radiation Hardening: No; Number of Contacts: 10; Housing Color: Black; Mount: Through Hole; Lead Pitch: 2.54mm; Termination: Solder; Color: Black; Contact Material: Nickel, Tin; Number of Pins: 10; Length: 25.4mm; Pitch: 2.54mm; Contact Plating: Tin; Contact Mating Length: 5.842mm